# Altium schematic sheet [02] Microcontroller.SchDoc: Microcontroller
size Letter; Revision: 1.0; PageSetup: Record=PageOptions|CenterHorizontal=True|CenterVertical=True|PrintScale=1.00|XCorrection=1.00|YCorrection=1.00|PrintKind=1|BorderSize=5000000|LeftOffset=0|BottomOffset=0|Orientation=2|PaperLength=1000|PaperWidth=1000|Scale=100|PaperSource=7|PrintQuality=-3|MediaType=1|DitherType=10|PrintScaleMode=1|PaperKind=Letter|PaperIndex=1; ProjectTitle: Data Acquisition System
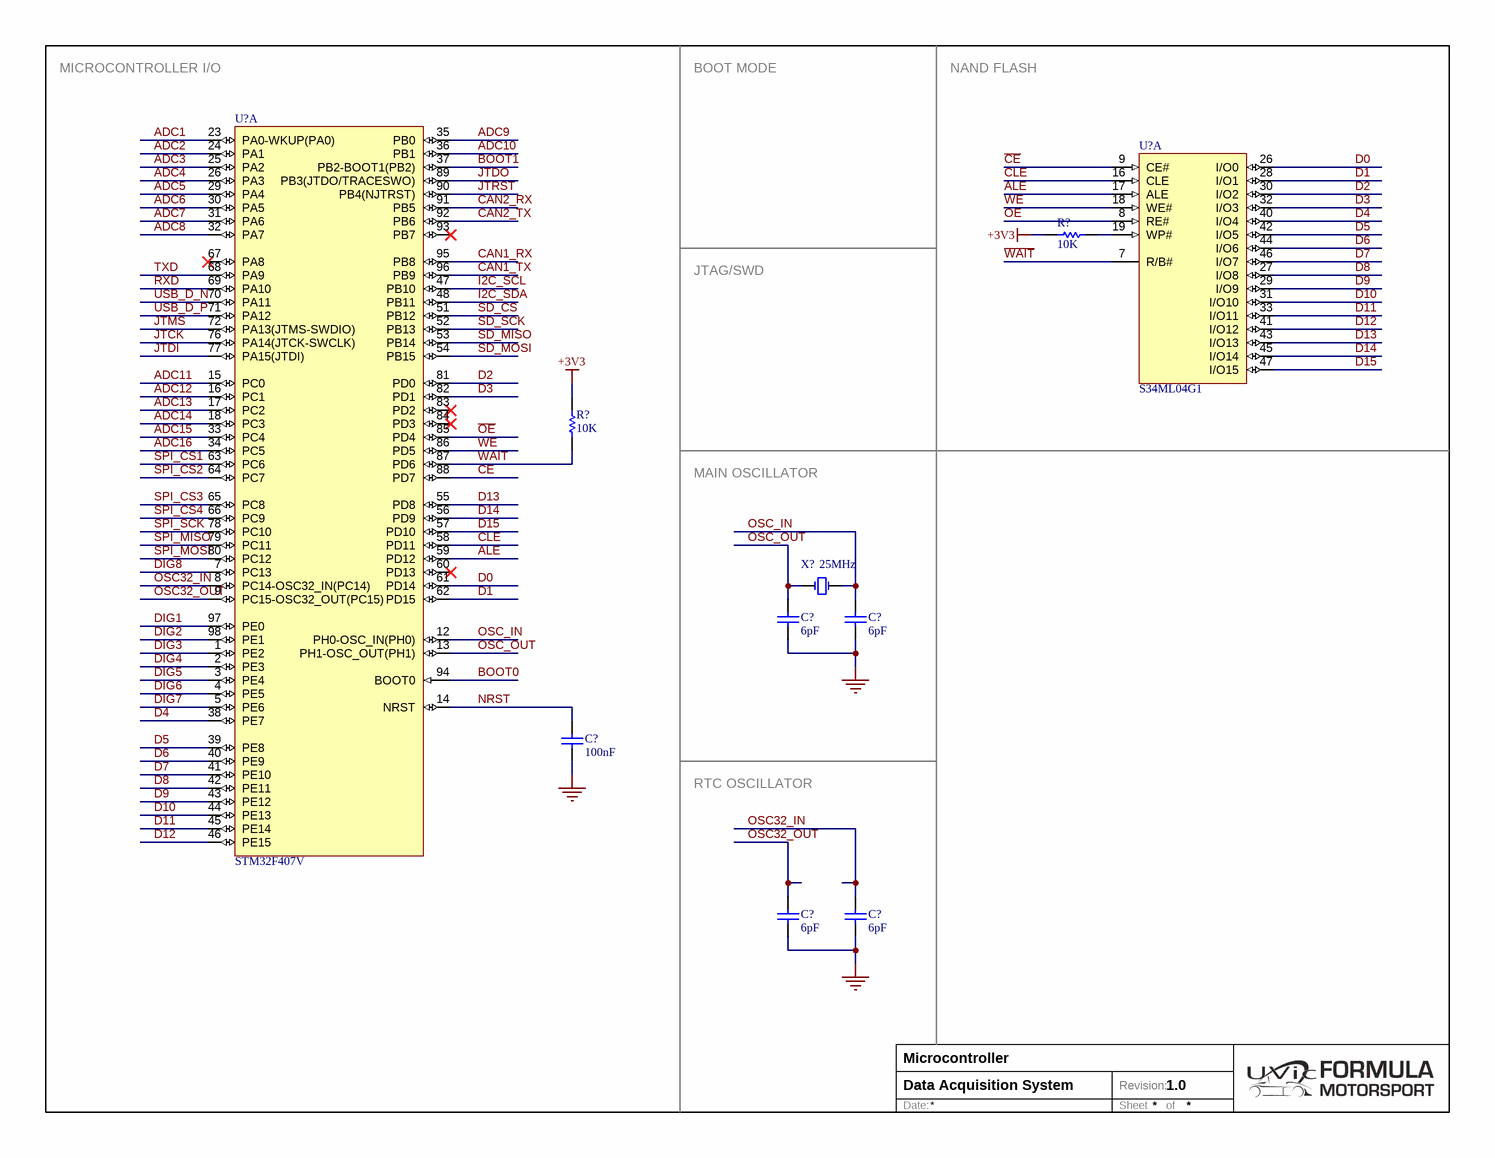
[diagram p0: [02] Microcontroller.SchDoc]

## Parts
(Parts that share a designator on the sheet are numbered #1, #2 ... from top to bottom, then left to right.)
C?#1  value 6pF  [CAP-1.6x0.8-0603]  (hidden comment: C1608C0G1H060C080AA)
C?#2  value 6pF  [CAP-1.6x0.8-0603]  (hidden comment: C1608C0G1H060C080AA)
C?#3  value 100nF  [CAP-1.6x0.8-0603]  (hidden comment: GRM188R71C104KA01D)
C?#4  value 6pF  [CAP-1.6x0.8-0603]  (hidden comment: C1608C0G1H060C080AA)
C?#5  value 6pF  [CAP-1.6x0.8-0603]  (hidden comment: C1608C0G1H060C080AA)
R?#1  value 10K  [RES-1.6x0.8-0603]  (hidden comment: RC0603FR-0710KL)
R?#2  value 10K  [RES-1.6x0.8-0603]  (hidden comment: RC0603FR-0710KL)
U?#1  STM32F407V  [100-LQFP-14x14-0.5]  (part A of 2)
U?#2  S34ML04G1  [48-TSOP]  (part A of 2)
X?  value 25MHz  [TXC-AA]  (hidden comment: AA-25.000M)

## Nets
+3V3: R?#1.2 R?#2.2
GND: C?#1.1 C?#2.1 C?#3.1 C?#4.1 C?#5.1
ADC1: U?#1.23(PA0-WKUP(PA0))
ADC2: U?#1.24(PA1)
ADC3: U?#1.25(PA2)
ADC4: U?#1.26(PA3)
ADC5: U?#1.29(PA4)
ADC6: U?#1.30(PA5)
ADC7: U?#1.31(PA6)
ADC8: U?#1.32(PA7)
ADC9: U?#1.35(PB0)
ADC10: U?#1.36(PB1)
ADC11: U?#1.15(PC0)
ADC12: U?#1.16(PC1)
ADC13: U?#1.17(PC2)
ADC14: U?#1.18(PC3)
ADC15: U?#1.33(PC4)
ADC16: U?#1.34(PC5)
ALE: U?#1.59(PD12) U?#2.17(ALE)
BOOT0: U?#1.94(BOOT0)
BOOT1: U?#1.37(PB2-BOOT1(PB2))
~{CE}: U?#1.88(PD7) U?#2.9(CE#)
CAN1_RX: U?#1.95(PB8)
CAN1_TX: U?#1.96(PB9)
CAN2_RX: U?#1.91(PB5)
CAN2_TX: U?#1.92(PB6)
CLE: U?#1.58(PD11) U?#2.16(CLE)
D0: U?#1.61(PD14) U?#2.26(I/O0)
D1: U?#1.62(PD15) U?#2.28(I/O1)
D2: U?#1.81(PD0) U?#2.30(I/O2)
D3: U?#1.82(PD1) U?#2.32(I/O3)
D4: U?#1.38(PE7) U?#2.40(I/O4)
D5: U?#1.39(PE8) U?#2.42(I/O5)
D6: U?#1.40(PE9) U?#2.44(I/O6)
D7: U?#1.41(PE10) U?#2.46(I/O7)
D8: U?#1.42(PE11) U?#2.27(I/O8)
D9: U?#1.43(PE12) U?#2.29(I/O9)
D10: U?#1.44(PE13) U?#2.31(I/O10)
D11: U?#1.45(PE14) U?#2.33(I/O11)
D12: U?#1.46(PE15) U?#2.41(I/O12)
D13: U?#1.55(PD8) U?#2.43(I/O13)
D14: U?#1.56(PD9) U?#2.45(I/O14)
D15: U?#1.57(PD10) U?#2.47(I/O15)
DIG1: U?#1.97(PE0)
DIG2: U?#1.98(PE1)
DIG3: U?#1.1(PE2)
DIG4: U?#1.2(PE3)
DIG5: U?#1.3(PE4)
DIG6: U?#1.4(PE5)
DIG7: U?#1.5(PE6)
DIG8: U?#1.7(PC13)
I2C_SCL: U?#1.47(PB10)
I2C_SDA: U?#1.48(PB11)
JTCK: U?#1.76(PA14(JTCK-SWCLK))
JTDI: U?#1.77(PA15(JTDI))
JTDO: U?#1.89(PB3(JTDO/TRACESWO))
JTMS: U?#1.72(PA13(JTMS-SWDIO))
JTRST: U?#1.90(PB4(NJTRST))
NRST: C?#3.2 U?#1.14(NRST)
~{OE}: U?#1.85(PD4) U?#2.8(RE#)
OSC32_IN: C?#5.2 U?#1.8(PC14-OSC32_IN(PC14))
OSC32_OUT: C?#4.2 U?#1.9(PC15-OSC32_OUT(PC15))
OSC_IN: C?#2.2 U?#1.12(PH0-OSC_IN(PH0)) X?.2
OSC_OUT: C?#1.2 U?#1.13(PH1-OSC_OUT(PH1)) X?.1
RXD: U?#1.69(PA10)
SD_CS: U?#1.51(PB12)
SD_MISO: U?#1.53(PB14)
SD_MOSI: U?#1.54(PB15)
SD_SCK: U?#1.52(PB13)
SPI_CS1: U?#1.63(PC6)
SPI_CS2: U?#1.64(PC7)
SPI_CS3: U?#1.65(PC8)
SPI_CS4: U?#1.66(PC9)
SPI_MISO: U?#1.79(PC11)
SPI_MOSI: U?#1.80(PC12)
SPI_SCK: U?#1.78(PC10)
TXD: U?#1.68(PA9)
USB_D_N: U?#1.70(PA11)
USB_D_P: U?#1.71(PA12)
~{WAIT}: R?#2.1 U?#1.87(PD6) U?#2.7(R/B#)
~{WE}: U?#1.86(PD5) U?#2.18(WE#)
NetR?#1_1: R?#1.1 U?#2.19(WP#)

Not connected (* = marked no-connect by the designer): U?#1 60(PD13)* 67(PA8)* 83(PD2)* 84(PD3)* 93(PB7)*

## Notes on the sheet
- MICROCONTROLLER I/O
- BOOT MODE
- NAND FLASH
- JTAG/SWD
- MAIN OSCILLATOR
- RTC OSCILLATOR
- Date:
- Revision:
- Sheet
- of

## Library data of the parts
C?#1 C?#2 C?#4 C?#5 = C1608C0G1H060C080AA: CAP CER 6pF 16V 0.25 C0G 0603; Supplier 1: Digi-Key; Supplier Part Number 1: 445-5036-1-ND
C?#3 = GRM188R71C104KA01D: CAP CER 0.1UF 16V 10% X7R 0603; Supplier 1: Digi-Key; Supplier Part Number 1: 490-1532-1-ND
R?#1 R?#2 = RC0603FR-0710KL: RES 0.1W 10K 1% 0603; Supplier 1: Digi-Key; Supplier Part Number 1: 311-10.0KHRCT-ND
U?#1 = STM32F407V: STM32F407 100-LQFP; Supplier 1: Digi-Key; Supplier Part Number 1: 497-11605-ND
X? = AA-25.000M: TXC AA SMD Automotive Crystal; Supplier 1: Digi-Key; Supplier Part Number 1: 887-1662-1-ND